# Altium project Lemon.PrjPcb
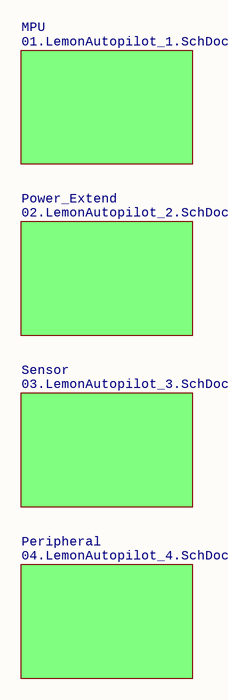
[diagram p0: 00.LemonAutopilot_0.SchDoc]
5 sheets, 96 parts. Net scope: global (net labels, ports and power ports of the same name join across sheets).
Board file: Lemon_Pi_V1.0.PcbDoc
Sheets:
  00.LemonAutopilot_0.SchDoc
    MPU = 01.LemonAutopilot_1.SchDoc
    Power_Extend = 02.LemonAutopilot_2.SchDoc
    Sensor = 03.LemonAutopilot_3.SchDoc
    Peripheral = 04.LemonAutopilot_4.SchDoc

## Sheet 00.LemonAutopilot_0.SchDoc
size A4

### Sub-sheets
MPU = 01.LemonAutopilot_1.SchDoc: no entries
Peripheral = 04.LemonAutopilot_4.SchDoc: no entries
Power_Extend = 02.LemonAutopilot_2.SchDoc: no entries
Sensor = 03.LemonAutopilot_3.SchDoc: no entries

## Sheet 01.LemonAutopilot_1.SchDoc
size A4
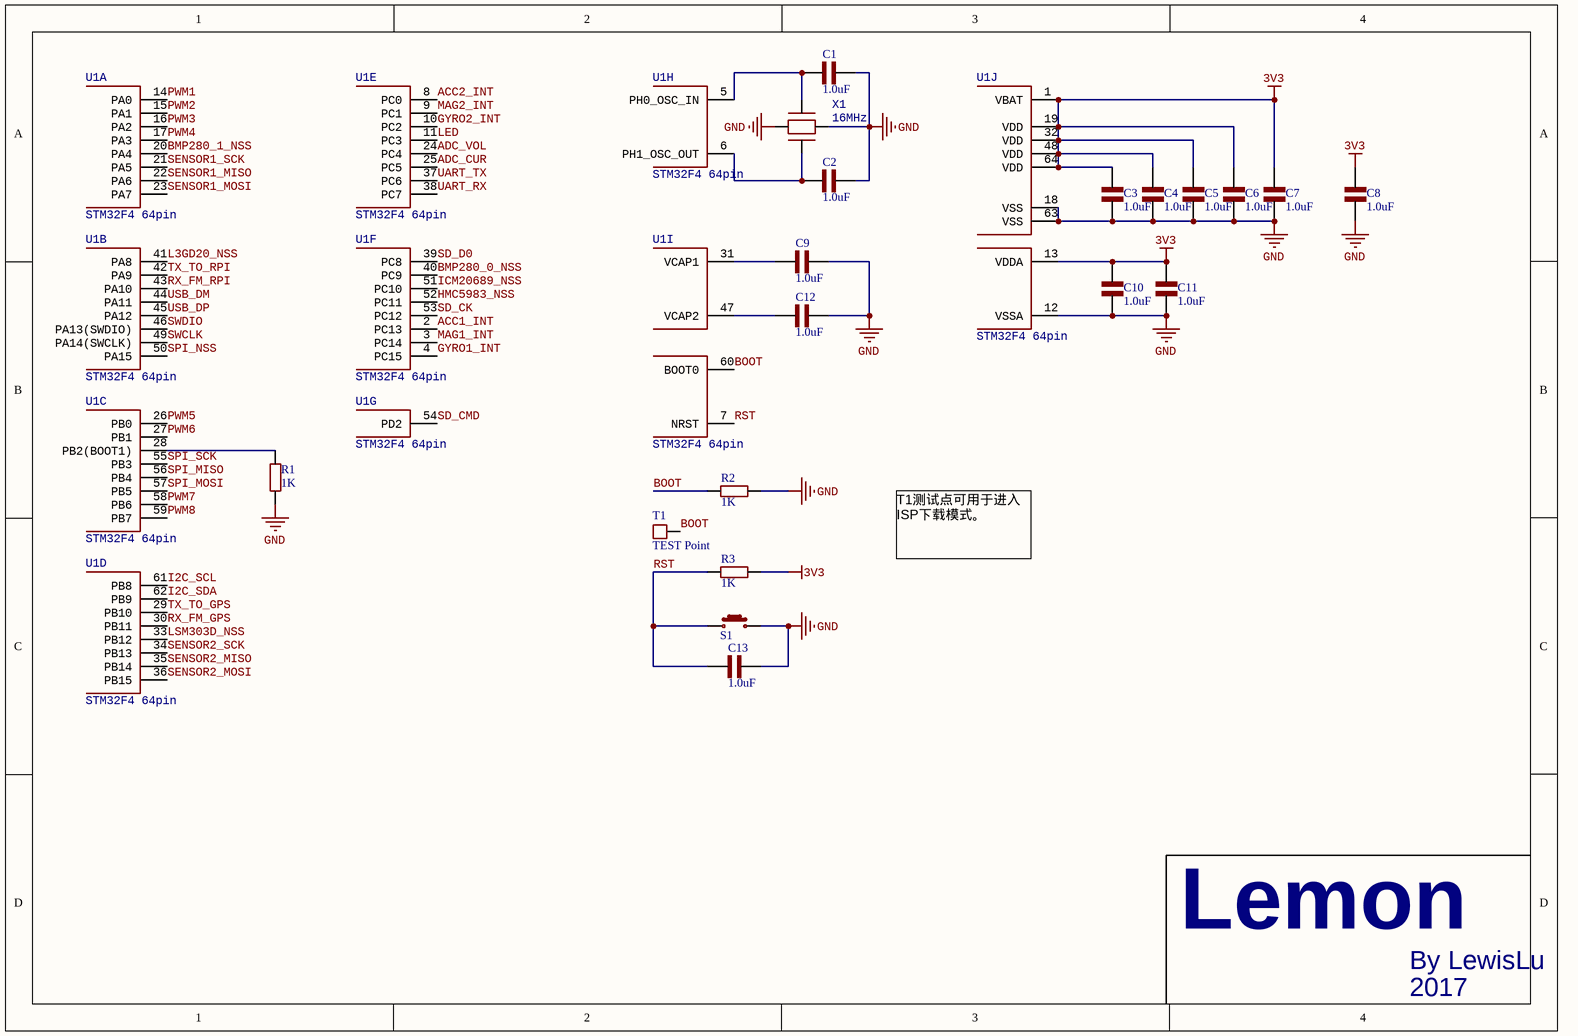
[diagram p1: 01.LemonAutopilot_1.SchDoc]

### Parts
C1  1.0uF  [0603_C]
C2  1.0uF  [0603_C]
C3  1.0uF  [0603_C]
C4  1.0uF  [0603_C]
C5  1.0uF  [0603_C]
C6  1.0uF  [0603_C]
C7  1.0uF  [0603_C]
C8  1.0uF  [0603_C]
C9  1.0uF  [0603_C]
C10  1.0uF  [0603_C]
C11  1.0uF  [0603_C]
C12  1.0uF  [0603_C]
C13  1.0uF  [0603_C]
R1  1K  [0603_R]
R2  1K  [0603_R]
R3  1K  [0603_R]
S1  SW  [SW_3*6]  (value not drawn)
T1  TEST Point  [TEST]
U1  STM32F4 64pin  [LQFP-64]  (parts A,B,C,D,E,F,G,H,I,J of 10)
X1  16MHz  [XTAL_3225]

### Nets
3V3: C3.2 C4.2 C5.2 C6.2 C7.2 C8.2 C10.2 C11.2 R3.2 U1.1(VBAT) U1.13(VDDA) U1.19(VDD) U1.32(VDD) U1.48(VDD) U1.64(VDD)
GND: C1.2 C2.2 C3.1 C4.1 C5.1 C6.1 C7.1 C8.1 C9.2 C10.1 C11.1 C12.2 C13.2 R1.2 R2.2 S1.2 U1.12(VSSA) U1.18(VSS) U1.63(VSS) X1.2 X1.4
ACC1_INT: U1.2(PC13) U1.3(PC14) U1.4(PC15) U1.21(PA5) U1.22(PA6) U1.23(PA7) U1.40(PC9) U1.51(PC10) U1.52(PC11)  [also labelled BMP280_0_NSS, GYRO1_INT, HMC5983_NSS, ICM20689_NSS, MAG1_INT, SENSOR1_MISO, SENSOR1_MOSI, SENSOR1_SCK]
ACC2_INT: U1.8(PC0)
ADC_CUR: U1.25(PC5)
ADC_VOL: U1.24(PC4)
BMP280_1_NSS: U1.20(PA4)
BOOT: R2.1 T1.0(TEST) U1.60(BOOT0)
GYRO2_INT: U1.10(PC2)
I2C_SCL: U1.61(PB8)
I2C_SDA: U1.62(PB9)
L3GD20_NSS: U1.41(PA8)
LED: U1.11(PC3)
LSM303D_NSS: U1.33(PB12)
MAG2_INT: U1.9(PC1)
PWM1: U1.14(PA0)
PWM2: U1.15(PA1)
PWM3: U1.16(PA2)
PWM4: U1.17(PA3)
PWM5: U1.26(PB0)
PWM6: U1.27(PB1)
PWM7: U1.58(PB6)
PWM8: U1.59(PB7)
RST: C13.1 R3.1 S1.1 U1.7(NRST)
RX_FM_GPS: U1.30(PB11)
RX_FM_RPI: U1.43(PA10)
SD_CK: U1.53(PC12)
SD_CMD: U1.54(PD2)
SD_D0: U1.39(PC8)
SENSOR2_MISO: U1.35(PB14)
SENSOR2_MOSI: U1.36(PB15)
SENSOR2_SCK: U1.34(PB13)
SPI_MISO: U1.56(PB4)
SPI_MOSI: U1.57(PB5)
SPI_NSS: U1.50(PA15)
SPI_SCK: U1.55(PB3)
SWCLK: U1.49(PA14(SWCLK))
SWDIO: U1.46(PA13(SWDIO))
TX_TO_GPS: U1.29(PB10)
TX_TO_RPI: U1.42(PA9)
UART_RX: U1.38(PC7)
UART_TX: U1.37(PC6)
USB_DM: U1.44(PA11)
USB_DP: U1.45(PA12)
NetC1_1: C1.1 U1.5(PH0_OSC_IN) X1.1
NetC2_1: C2.1 U1.6(PH1_OSC_OUT) X1.3
NetC9_1: C9.1 U1.31(VCAP1)
NetC12_1: C12.1 U1.47(VCAP2)
NetR1_1: R1.1 U1.28(PB2(BOOT1))

### Notes on the sheet
- T1测试点可用于进入ISP下载模式。
- Lemon
- By LewisLu
- 2017

### Library data of the parts
C1-C13 = C0603
R1-R3 = R0603
S1 = S2
T1 = TEST
U1 = STM32F40XRX: MCU ARM 1MB FLASH 64LQFP
X1 = XTAL_16MHz

## Sheet 02.LemonAutopilot_2.SchDoc
size A4
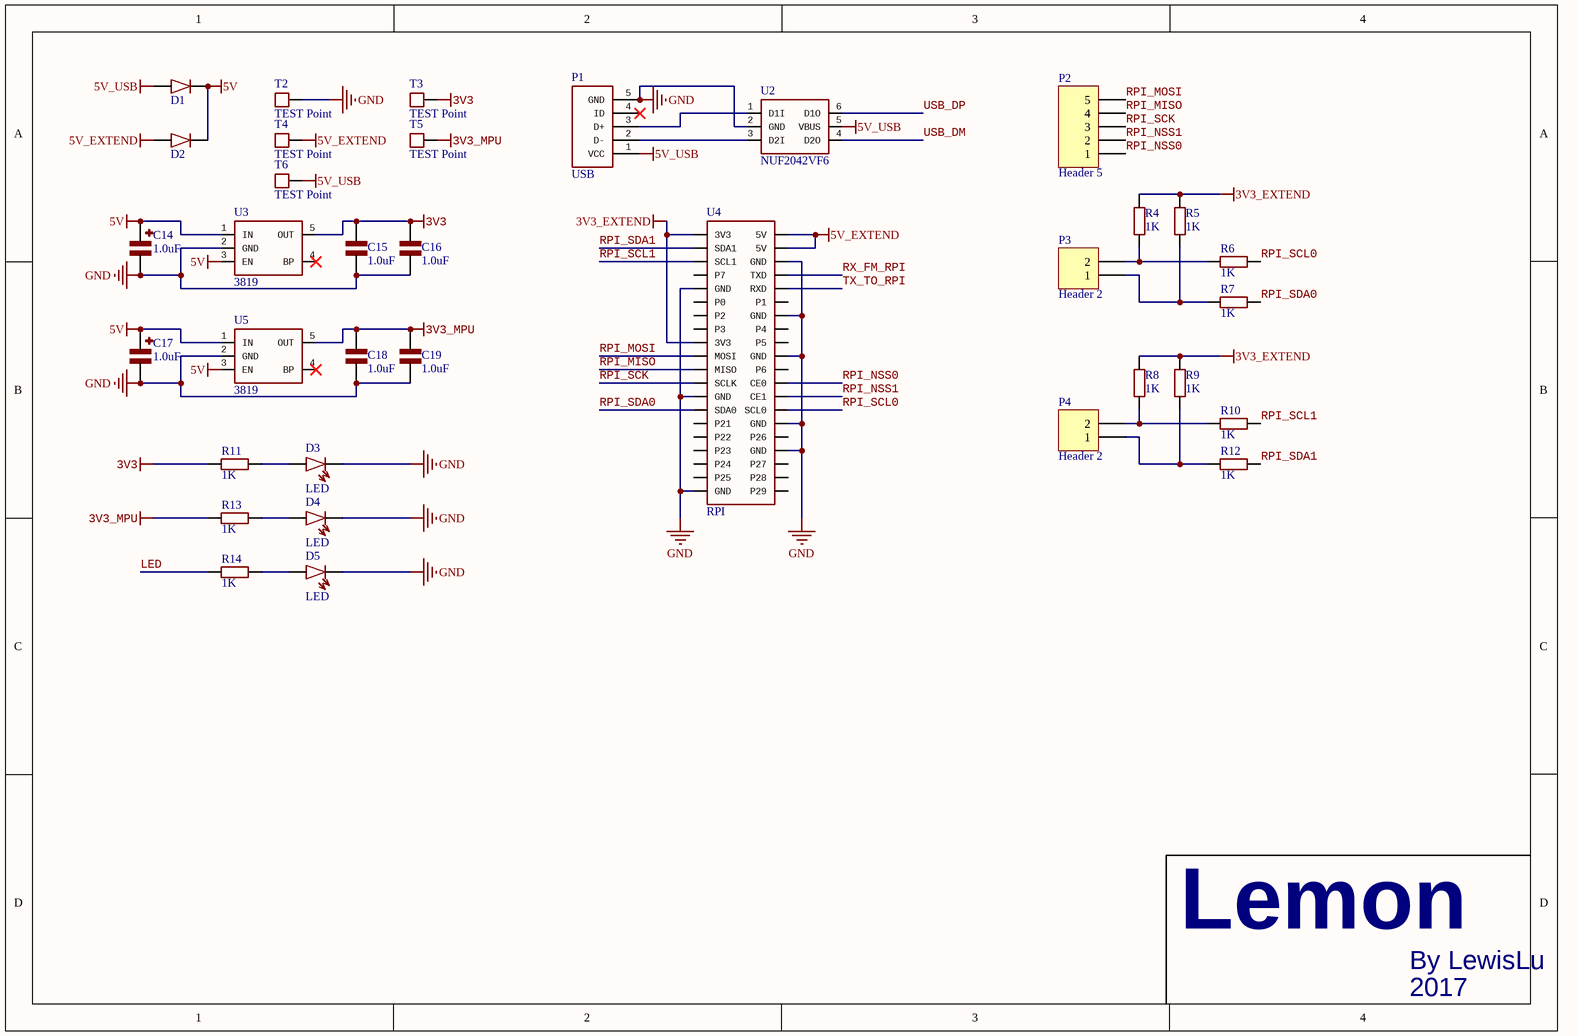
[diagram p2: 02.LemonAutopilot_2.SchDoc]

### Parts
C14  1.0uF  [3216_C]
C15  1.0uF  [0603_C]
C16  1.0uF  [0603_C]
C17  1.0uF  [3216_C]
C18  1.0uF  [0603_C]
C19  1.0uF  [0603_C]
D1  D  [SOD-323]  (value not drawn)
D2  D  [SOD-323]  (value not drawn)
D3  LED  [0603_D]
D4  LED  [0603_D]
D5  LED  [0603_D]
P1  USB  [MICROUSB]
P2  Header 5  [HDR1X5]
P3  Header 2  [HDR1X2]
P4  Header 2  [HDR1X2]
R4  1K  [0603_R]
R5  1K  [0603_R]
R6  1K  [0603_R]
R7  1K  [0603_R]
R8  1K  [0603_R]
R9  1K  [0603_R]
R10  1K  [0603_R]
R11  1K  [0603_R]
R12  1K  [0603_R]
R13  1K  [0603_R]
R14  1K  [0603_R]
T2  TEST Point  [TEST]
T3  TEST Point  [TEST]
T4  TEST Point  [TEST]
T5  TEST Point  [TEST]
T6  TEST Point  [TEST]
U2  NUF2042VF6
U3  3819  [SOT23-5]
U4  RPI
U5  3819  [SOT23-5]

### Nets
3V3: C15.2 C16.2 R11.1 T3.0(TEST) U3.5(OUT)
3V3_EXTEND: R4.1 R5.1 R8.1 R9.1 U4.1(3V3) U4.17(3V3)
3V3_MPU: C18.2 C19.2 R13.1 T5.0(TEST) U5.5(OUT)
5V: C14.1 C17.1 D1.2 D2.2 U3.1(IN) U3.3(EN) U5.1(IN) U5.3(EN)
5V_EXTEND: D2.1 T4.0(TEST) U4.2(5V) U4.4(5V)
5V_USB: D1.1 P1.1(VCC) T6.0(TEST) U2.5(VBUS)
GND: C14.2 C15.1 C16.1 C17.2 C18.1 C19.1 D3.2 D4.2 D5.2 P1.5(GND) T2.0(TEST) U2.2(GND) U3.2(GND) U4.6(GND) U4.9(GND) U4.14(GND) U4.20(GND) U4.25(GND) U4.30(GND) U4.34(GND) U4.39(GND) U5.2(GND)
LED: R14.1
RPI_MISO: P2.4 U4.21(MISO)
RPI_MOSI: P2.5 U4.19(MOSI)
RPI_NSS0: P2.1 U4.24(CE0)
RPI_NSS1: P2.2 U4.26(CE1)
RPI_SCK: P2.3 U4.23(SCLK)
RPI_SCL0: R6.2 U4.28(SCL0)
RPI_SCL1: R10.2 U4.5(SCL1)
RPI_SDA0: R7.2 U4.27(SDA0)
RPI_SDA1: R12.2 U4.3(SDA1)
RX_FM_RPI: U4.8(TXD)
TX_TO_RPI: U4.10(RXD)
USB_DM: U2.4(D2O)
USB_DP: U2.6(D1O)
NetD3_1: D3.1 R11.2
NetD4_1: D4.1 R13.2
NetD5_1: D5.1 R14.2
NetP1_2: P1.2(D-) U2.3(D2I)
NetP1_3: P1.3(D+) U2.1(D1I)
NetP3_1: P3.1 R5.2 R7.1
NetP3_2: P3.2 R4.2 R6.1
NetP4_1: P4.1 R9.2 R12.1
NetP4_2: P4.2 R8.2 R10.1

Not connected (* = marked no-connect by the designer): P1 4(ID)*; U3 4(BP)*; U4 7(P7) 11(P0) 12(P1) 13(P2) 15(P3) 16(P4) 18(P5) 22(P6) 29(P21) 31(P22) 32(P26) 33(P23) 35(P24) 36(P27) 37(P25) 38(P28) 40(P29); U5 4(BP)*

### Notes on the sheet
- Lemon
- By LewisLu
- 2017

### Library data of the parts
C14 C17 = C3216
C15 C16 C18 C19 = C0603
D1 D2 = D0603
D3-D5 = D0603_LED
P2 = Header 5: Header, 5-Pin; LatestRevisionDate: 17-Jul-2002; LatestRevisionNote: Re-released for DXP Platform.; Publisher: Altium Limited
P3 P4 = Header 2: Header, 2-Pin; LatestRevisionDate: 17-Jul-2002; LatestRevisionNote: Re-released for DXP Platform.; Publisher: Altium Limited
R4-R14 = R0603
T2-T6 = TEST
U2 = NUF2042XV6
U3 U5 = SPX3819
U4 = RPI_EXTEND

## Sheet 03.LemonAutopilot_3.SchDoc
size A4
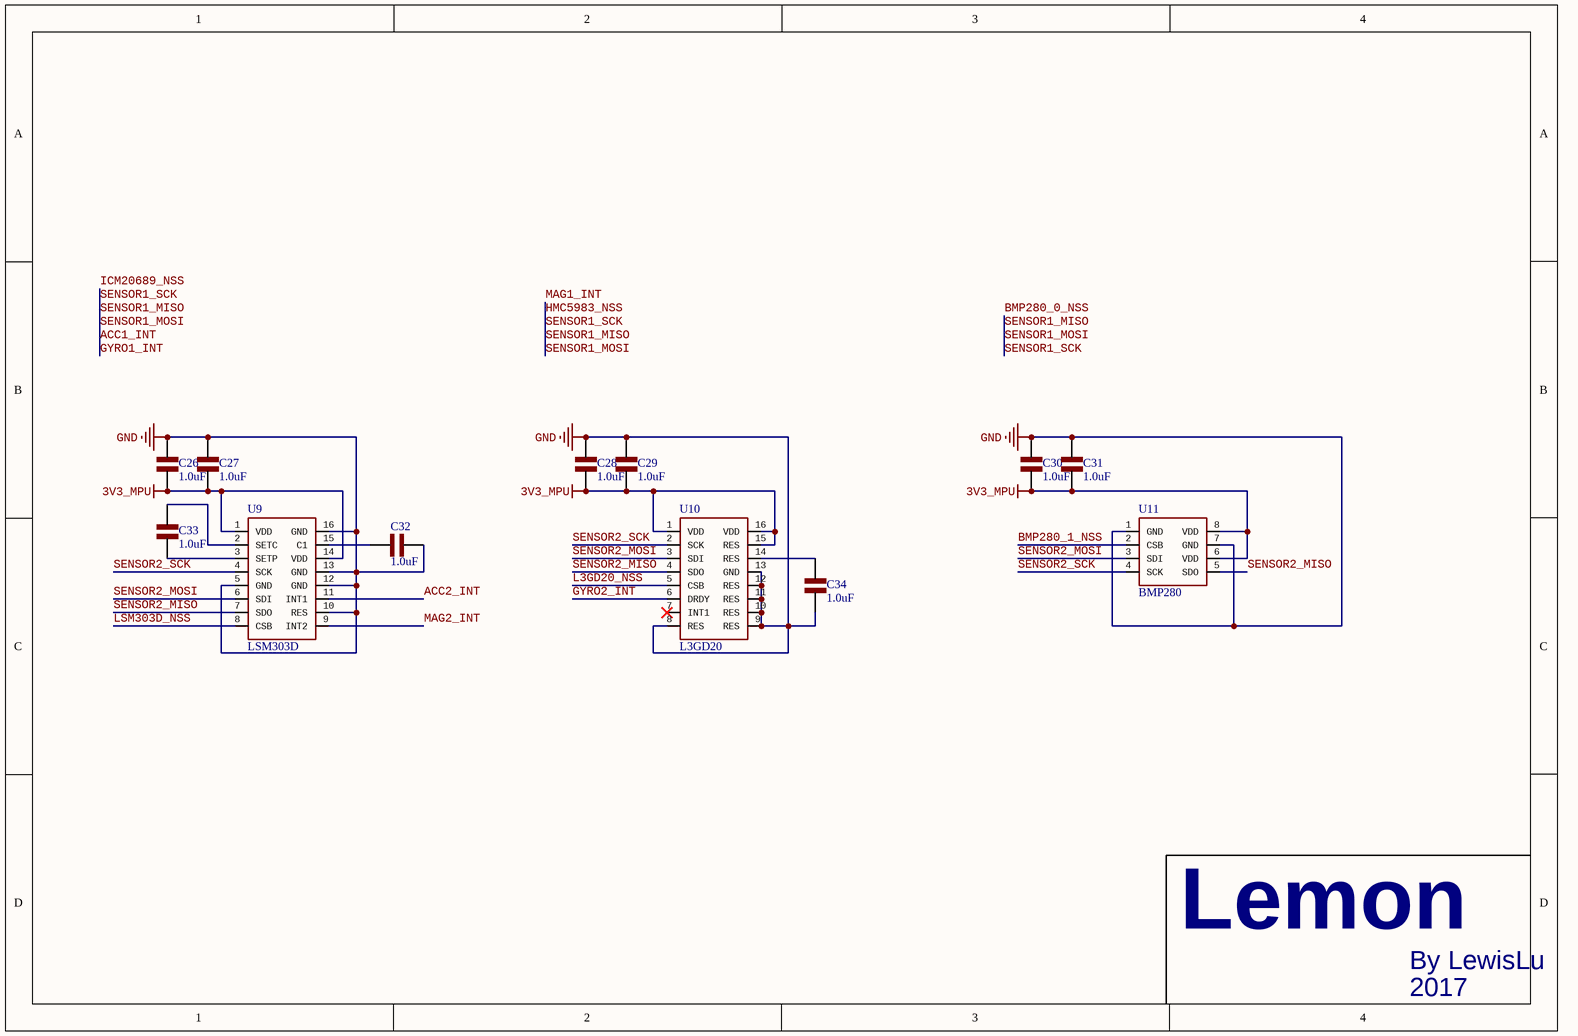
[diagram p3: 03.LemonAutopilot_3.SchDoc]

### Parts
C26  1.0uF  [0603_C]
C27  1.0uF  [0603_C]
C28  1.0uF  [0603_C]
C29  1.0uF  [0603_C]
C30  1.0uF  [0603_C]
C31  1.0uF  [0603_C]
C32  1.0uF  [0603_C]
C33  1.0uF  [0603_C]
C34  1.0uF  [0603_C]
U9  LSM303D
U10  L3GD20
U11  BMP280

### Nets
3V3_MPU: C26.1 C27.1 C28.1 C29.1 C30.2 C31.2 U9.1(VDD) U9.14(VDD) U10.1(VDD) U10.15(RES) U10.16(VDD) U11.6(VDD) U11.8(VDD)
GND: C26.2 C27.2 C28.2 C29.2 C30.1 C31.1 C32.1 C34.1 U9.5(GND) U9.10(RES) U9.12(GND) U9.13(GND) U9.16(GND) U10.8(RES) U10.9(RES) U10.10(RES) U10.11(RES) U10.12(RES) U10.13(GND) U11.1(GND) U11.7(GND)
ACC2_INT: U9.11(INT1)
BMP280_1_NSS: U11.2(CSB)
GYRO2_INT: U10.6(DRDY)
L3GD20_NSS: U10.5(CSB)
LSM303D_NSS: U9.8(CSB)
MAG2_INT: U9.9(INT2)
SENSOR2_MISO: U9.7(SDO) U10.4(SDO) U11.5(SDO)
SENSOR2_MOSI: U9.6(SDI) U10.3(SDI) U11.3(SDI)
SENSOR2_SCK: U9.4(SCK) U10.2(SCK) U11.4(SCK)
NetC32_2: C32.2 U9.15(C1)
NetC33_1: C33.1 U9.3(SETP)
NetC33_2: C33.2 U9.2(SETC)
NetC34_2: C34.2 U10.14(RES)

Not connected (* = marked no-connect by the designer): U10 7(INT1)*

### Notes on the sheet
- Lemon
- By LewisLu
- 2017

### Library data of the parts
C26-C34 = C0603

## Sheet 04.LemonAutopilot_4.SchDoc
size A4
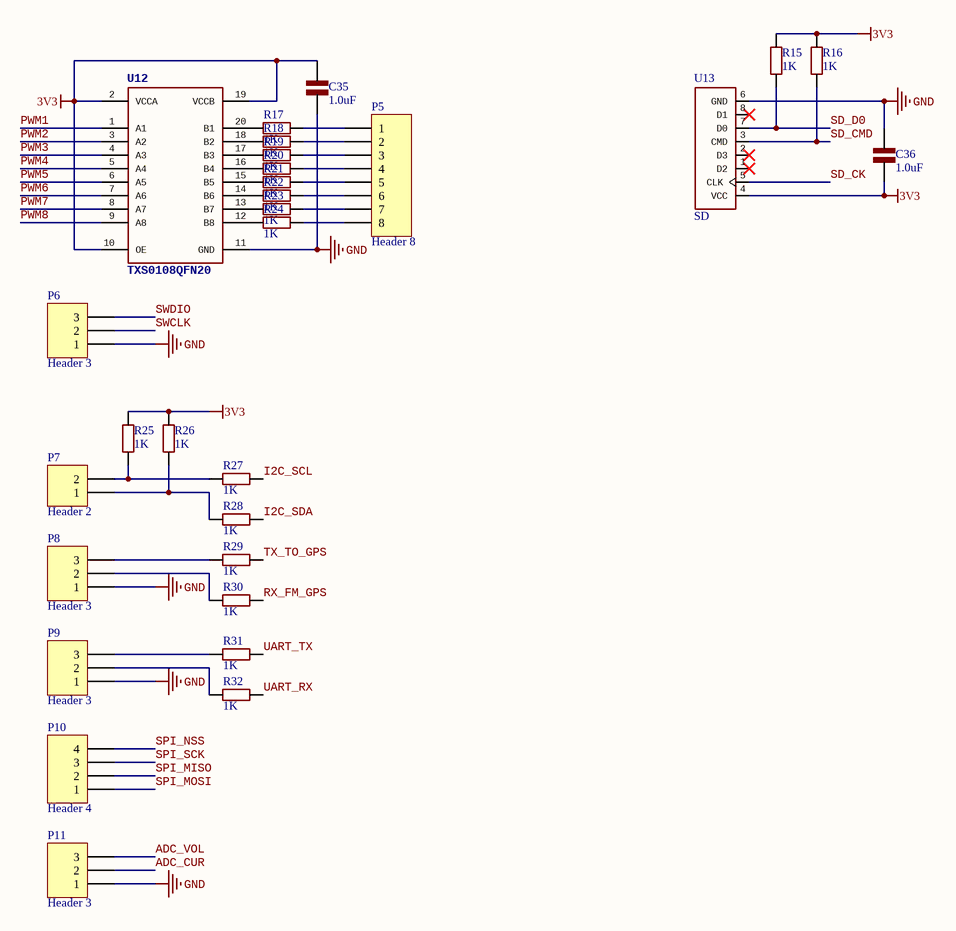
[diagram p4: 04.LemonAutopilot_4.SchDoc]

### Parts
C35  1.0uF  [0603_C]
C36  1.0uF  [0603_C]
P5  Header 8  [HDR1X8]
P6  Header 3  [HDR1X3]
P7  Header 2  [HDR1X2]
P8  Header 3  [HDR1X3]
P9  Header 3  [HDR1X3]
P10  Header 4  [HDR1X4]
P11  Header 3  [HDR1X3]
R15  1K  [0603_R]
R16  1K  [0603_R]
R17  1K  [0603_R]
R18  1K  [0603_R]
R19  1K  [0603_R]
R20  1K  [0603_R]
R21  1K  [0603_R]
R22  1K  [0603_R]
R23  1K  [0603_R]
R24  1K  [0603_R]
R25  1K  [0603_R]
R26  1K  [0603_R]
R27  1K  [0603_R]
R28  1K  [0603_R]
R29  1K  [0603_R]
R30  1K  [0603_R]
R31  1K  [0603_R]
R32  1K  [0603_R]
U12  TXS0108QFN20  [QFN20-RGY]
U13  SD

### Nets
3V3: C35.2 C36.1 R15.1 R16.1 R25.1 R26.1 U12.2(VCCA) U12.10(OE) U12.19(VCCB) U13.4(VCC)
GND: C35.1 C36.2 P6.1 P8.1 P9.1 P11.1 U12.11(GND) U13.6(GND)
ADC_CUR: P11.2
ADC_VOL: P11.3
I2C_SCL: R27.2
I2C_SDA: R28.2
PWM1: U12.1(A1)
PWM2: U12.3(A2)
PWM3: U12.4(A3)
PWM4: U12.5(A4)
PWM5: U12.6(A5)
PWM6: U12.7(A6)
PWM7: U12.8(A7)
PWM8: U12.9(A8)
RX_FM_GPS: R30.2
SD_CK: U13.5(CLK)
SD_CMD: R16.2 U13.3(CMD)
SD_D0: R15.2 U13.7(D0)
SPI_MISO: P10.2
SPI_MOSI: P10.1
SPI_NSS: P10.4
SPI_SCK: P10.3
SWCLK: P6.2
SWDIO: P6.3
TX_TO_GPS: R29.2
UART_RX: R32.2
UART_TX: R31.2
NetP5_1: P5.1 R17.2
NetP5_2: P5.2 R18.2
NetP5_3: P5.3 R19.2
NetP5_4: P5.4 R20.2
NetP5_5: P5.5 R21.2
NetP5_6: P5.6 R22.2
NetP5_7: P5.7 R23.2
NetP5_8: P5.8 R24.2
NetP7_1: P7.1 R26.2 R28.1
NetP7_2: P7.2 R25.2 R27.1
NetP8_2: P8.2 R30.1
NetP8_3: P8.3 R29.1
NetP9_2: P9.2 R32.1
NetP9_3: P9.3 R31.1
NetR17_1: R17.1 U12.20(B1)
NetR18_1: R18.1 U12.18(B2)
NetR19_1: R19.1 U12.17(B3)
NetR20_1: R20.1 U12.16(B4)
NetR21_1: R21.1 U12.15(B5)
NetR22_1: R22.1 U12.14(B6)
NetR23_1: R23.1 U12.13(B7)
NetR24_1: R24.1 U12.12(B8)

Not connected (* = marked no-connect by the designer): U13 1(D2)* 2(D3)* 8(D1)*

### Library data of the parts
C35 C36 = C0603
P5 = Header 8: Header, 8-Pin; LatestRevisionDate: 17-Jul-2002; LatestRevisionNote: Re-released for DXP Platform.; Publisher: Altium Limited
P6 P8 P9 P11 = Header 3: Header, 3-Pin; LatestRevisionDate: 17-Jul-2002; LatestRevisionNote: Re-released for DXP Platform.; Publisher: Altium Limited
P7 = Header 2: Header, 2-Pin; LatestRevisionDate: 17-Jul-2002; LatestRevisionNote: Re-released for DXP Platform.; Publisher: Altium Limited
P10 = Header 4: Header, 4-Pin; LatestRevisionDate: 17-Jul-2002; LatestRevisionNote: Re-released for DXP Platform.; Publisher: Altium Limited
R15-R32 = R0603

## Nets that join several sheets
3V3: 01.LemonAutopilot_1 (15 pins), 02.LemonAutopilot_2 (5 pins), 04.LemonAutopilot_4 (10 pins)
3V3_MPU: 02.LemonAutopilot_2 (5 pins), 03.LemonAutopilot_3 (13 pins)
GND: 01.LemonAutopilot_1 (21 pins), 02.LemonAutopilot_2 (22 pins), 03.LemonAutopilot_3 (21 pins), 04.LemonAutopilot_4 (8 pins)
ACC2_INT: 01.LemonAutopilot_1 (U1.8), 03.LemonAutopilot_3 (U9.11)
ADC_CUR: 01.LemonAutopilot_1 (U1.25), 04.LemonAutopilot_4 (P11.2)
ADC_VOL: 01.LemonAutopilot_1 (U1.24), 04.LemonAutopilot_4 (P11.3)
BMP280_1_NSS: 01.LemonAutopilot_1 (U1.20), 03.LemonAutopilot_3 (U11.2)
GYRO2_INT: 01.LemonAutopilot_1 (U1.10), 03.LemonAutopilot_3 (U10.6)
I2C_SCL: 01.LemonAutopilot_1 (U1.61), 04.LemonAutopilot_4 (R27.2)
I2C_SDA: 01.LemonAutopilot_1 (U1.62), 04.LemonAutopilot_4 (R28.2)
L3GD20_NSS: 01.LemonAutopilot_1 (U1.41), 03.LemonAutopilot_3 (U10.5)
LED: 01.LemonAutopilot_1 (U1.11), 02.LemonAutopilot_2 (R14.1)
LSM303D_NSS: 01.LemonAutopilot_1 (U1.33), 03.LemonAutopilot_3 (U9.8)
MAG2_INT: 01.LemonAutopilot_1 (U1.9), 03.LemonAutopilot_3 (U9.9)
PWM1: 01.LemonAutopilot_1 (U1.14), 04.LemonAutopilot_4 (U12.1)
PWM2: 01.LemonAutopilot_1 (U1.15), 04.LemonAutopilot_4 (U12.3)
PWM3: 01.LemonAutopilot_1 (U1.16), 04.LemonAutopilot_4 (U12.4)
PWM4: 01.LemonAutopilot_1 (U1.17), 04.LemonAutopilot_4 (U12.5)
PWM5: 01.LemonAutopilot_1 (U1.26), 04.LemonAutopilot_4 (U12.6)
PWM6: 01.LemonAutopilot_1 (U1.27), 04.LemonAutopilot_4 (U12.7)
PWM7: 01.LemonAutopilot_1 (U1.58), 04.LemonAutopilot_4 (U12.8)
PWM8: 01.LemonAutopilot_1 (U1.59), 04.LemonAutopilot_4 (U12.9)
RX_FM_GPS: 01.LemonAutopilot_1 (U1.30), 04.LemonAutopilot_4 (R30.2)
RX_FM_RPI: 01.LemonAutopilot_1 (U1.43), 02.LemonAutopilot_2 (U4.8)
SD_CK: 01.LemonAutopilot_1 (U1.53), 04.LemonAutopilot_4 (U13.5)
SD_CMD: 01.LemonAutopilot_1 (U1.54), 04.LemonAutopilot_4 (R16.2 U13.3)
SD_D0: 01.LemonAutopilot_1 (U1.39), 04.LemonAutopilot_4 (R15.2 U13.7)
SENSOR2_MISO: 01.LemonAutopilot_1 (U1.35), 03.LemonAutopilot_3 (U9.7 U10.4 U11.5)
SENSOR2_MOSI: 01.LemonAutopilot_1 (U1.36), 03.LemonAutopilot_3 (U9.6 U10.3 U11.3)
SENSOR2_SCK: 01.LemonAutopilot_1 (U1.34), 03.LemonAutopilot_3 (U9.4 U10.2 U11.4)
SPI_MISO: 01.LemonAutopilot_1 (U1.56), 04.LemonAutopilot_4 (P10.2)
SPI_MOSI: 01.LemonAutopilot_1 (U1.57), 04.LemonAutopilot_4 (P10.1)
SPI_NSS: 01.LemonAutopilot_1 (U1.50), 04.LemonAutopilot_4 (P10.4)
SPI_SCK: 01.LemonAutopilot_1 (U1.55), 04.LemonAutopilot_4 (P10.3)
SWCLK: 01.LemonAutopilot_1 (U1.49), 04.LemonAutopilot_4 (P6.2)
SWDIO: 01.LemonAutopilot_1 (U1.46), 04.LemonAutopilot_4 (P6.3)
TX_TO_GPS: 01.LemonAutopilot_1 (U1.29), 04.LemonAutopilot_4 (R29.2)
TX_TO_RPI: 01.LemonAutopilot_1 (U1.42), 02.LemonAutopilot_2 (U4.10)
UART_RX: 01.LemonAutopilot_1 (U1.38), 04.LemonAutopilot_4 (R32.2)
UART_TX: 01.LemonAutopilot_1 (U1.37), 04.LemonAutopilot_4 (R31.2)
USB_DM: 01.LemonAutopilot_1 (U1.44), 02.LemonAutopilot_2 (U2.4)
USB_DP: 01.LemonAutopilot_1 (U1.45), 02.LemonAutopilot_2 (U2.6)